# EAGLE schematic MorseCodeExternalMicCircuit_Eagle_schematic_file (EAGLE 7.2.0)
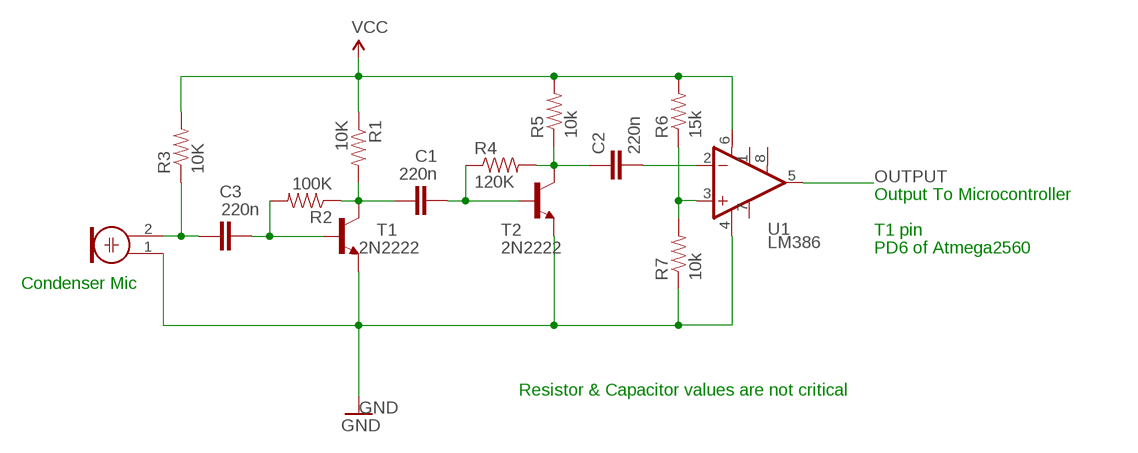
[diagram p0: schematic, sheet 1]

## Parts
C1  220n  0.1UF-50V-20%(PTH)KIT-EZ  [CAP-PTH-SMALL-KIT]
C2  220n  0.1UF-50V-20%(PTH)KIT-EZ  [CAP-PTH-SMALL-KIT]
C3  220n  0.1UF-50V-20%(PTH)KIT-EZ  [CAP-PTH-SMALL-KIT]
M1  ELECTRET_MICROPHON-F6050AP  [F6050AP]
R1  10K  RESISTOREZ  [AXIAL-0.3EZ]
R2  100K  RESISTOREZ  [AXIAL-0.3EZ]
R3  10K  RESISTOREZ  [AXIAL-0.3EZ]
R4  120K  RESISTOREZ  [AXIAL-0.3EZ]
R5  10k  RESISTOREZ  [AXIAL-0.3EZ]
R6  15k  RESISTOREZ  [AXIAL-0.3EZ]
R7  10k  RESISTOREZ  [AXIAL-0.3EZ]
T1  2N2222  [TO18]
T2  2N2222  [TO18]
U1  LM386  [DIP08]

## Nets
GND: M1.1 R7.P$1 T1.1(E) T2.1(E) U1.4(V-)
N$1: C2.2 U1.2(-IN)
N$2: C3.1 M1.2 R3.P$1
N$3: C3.2 R2.P$2 T1.2(B)
N$4: C1.1 R1.P$2 R2.P$1 T1.3(C)
N$5: C1.2 R4.P$1 T2.2(B)
N$6: C2.1 R4.P$2 R5.P$1 T2.3(C)
N$7: R6.P$1 R7.P$2 U1.3(+IN)
OUTPUT: U1.5(OUT)
VCC: R1.P$1 R3.P$2 R5.P$2 R6.P$2 U1.6(V+)
Unconnected: U1.1(GAIN) U1.7(BP) U1.8(GAIN)

## Notes on the sheet
- Output To Microcontroller
- T1 pin
- PD6 of Atmega2560
- Condenser Mic
- Resistor & Capacitor values are not critical

## Library data of the parts
C1-C3 = SparkFun-Capacitors:0.1UF-50V-20%(PTH): CAP-08370; PROD_ID: CAP-08370
M1 = microphon:ELECTRET_MICROPHON-: Electret Condenser Microphone
R1-R7 = SparkFun-Resistors:RESISTOR: Resistor Basic schematic elements and footprints for 0603, 1206, and PTH resistors.
T1 T2 = transistor:2N2222: NPN TRANSISTOR
U1 = SparkFun-AnalogIC:LM386: low voltage audio power amplifier